# EAGLE design led3x3 (EAGLE 7.1.0)
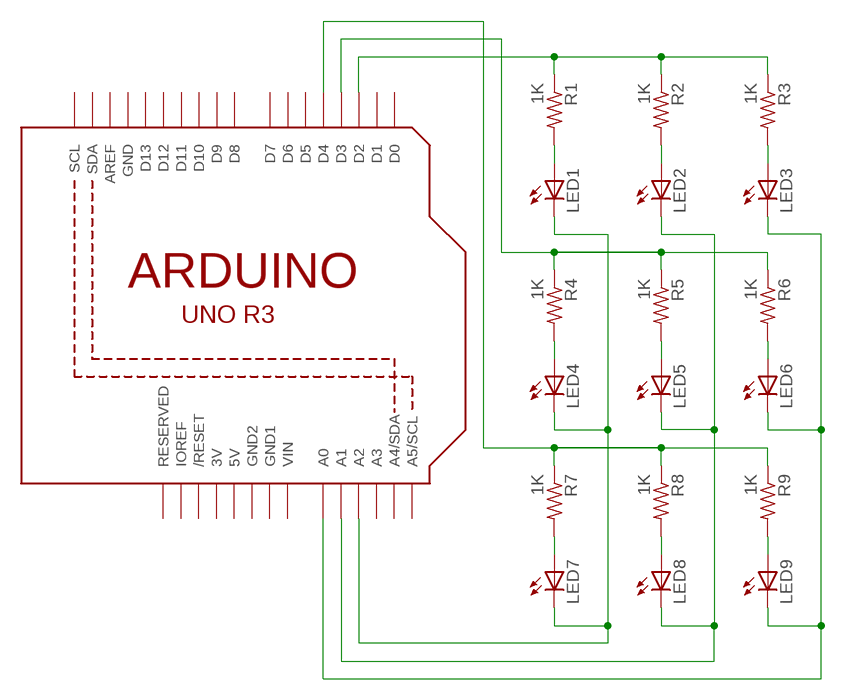
[diagram p0: schematic, sheet 1]

## Parts
LED1  LED5MM  [LED5MM]
LED2  LED5MM  [LED5MM]
LED3  LED5MM  [LED5MM]
LED4  LED5MM  [LED5MM]
LED5  LED5MM  [LED5MM]
LED6  LED5MM  [LED5MM]
LED7  LED5MM  [LED5MM]
LED8  LED5MM  [LED5MM]
LED9  LED5MM  [LED5MM]
R1  1K  R-US_0207/10  [0207/10]
R2  1K  R-US_0207/10  [0207/10]
R3  1K  R-US_0207/10  [0207/10]
R4  1K  R-US_0207/10  [0207/10]
R5  1K  R-US_0207/10  [0207/10]
R6  1K  R-US_0207/10  [0207/10]
R7  1K  R-US_0207/10  [0207/10]
R8  1K  R-US_0207/10  [0207/10]
R9  1K  R-US_0207/10  [0207/10]
U1  ARDUINOR3-BPLACE  [ARDUINOR3-BPLACE]

## Nets
D3: R4.1 R5.1 R6.1 U1.D3
N$1: LED3.K(C) LED6.K(C) LED9.K(C) U1.A0
N$2: LED1.A R1.2
N$3: LED2.K(C) LED5.K(C) LED8.K(C) U1.A1
N$4: R1.1 R2.1 R3.1 U1.D2
N$5: LED2.A R2.2
N$6: R7.1 R8.1 R9.1 U1.D4
N$7: LED1.K(C) LED4.K(C) LED7.K(C) U1.A2
N$8: LED3.A R3.2
N$11: LED4.A R4.2
N$14: LED5.A R5.2
N$17: LED6.A R6.2
N$20: LED7.A R7.2
N$23: LED8.A R8.2
N$26: LED9.A R9.2
Unconnected: U1.A3 U1.A4(A4/SDA) U1.A5(A5/SCL) U1.AREF U1.D0 U1.D1 U1.D5 U1.D6 U1.D7 U1.D8 U1.D9 U1.D10 U1.D11 U1.D12 U1.D13 U1.IOREF U1.RESERVED U1.RESET(/RESET) U1.SCL U1.SDA

## Power pins joined to a net without a drawn wire
3V: U1.3V
5V: U1.5V
GND: U1.GND
GND1: U1.GND1
GND2: U1.GND2
VIN: U1.VIN

## Library data of the parts
LED1-LED9 = led:LED: LED OSRAM: - CHIPLED LG R971, LG N971, LY N971, LG Q971, LY Q971, LO R971, LY R971 LH N974, LH R974 LS Q976, LO Q976, LY Q976 LO Q996 - Hyper CHIPLED LW Q18S LB Q993, LB Q99A, LB R99A - SideLED LS A670, LO A670, LY A670, LG A670, LP A670 LB A673, LV A673, LT A673, LW A673 LH A674 LY A675 LS A676, LA A676, LO A676, LY A676, LW A676 LS A679, LY A679, LG A679 - Hyper Micro SIDELED® LS Y876, LA Y876, LO Y876, LY Y876 LT Y87S - SmartLED LW L88C, LW L88S LB L89C, LB L89S, LG L890 LS L89K, LO L89K, LY L89K LS L896, LA L896, LO L896, LY L896 - TOPLED LS T670, LO T670, LY T670, LG T670, LP T670 LSG T670, LSP T670, LSY T670, LOP T670, LYG T670 LG T671, LOG T671, LSG T671 LB T673, LV T673, LT T673, LW T673 LH T674 LS T676, LA T676, LO T676, LY T676, LB T676, LH T676, LSB T676, LW T676 LB T67C, LV T67C, LT T67C, LS T67K, LO T67K, LY T67K, LW E67C LS E67B, LA E67B, LO E67B, LY E67B, LB E67C, LV E67C, LT E67C LW T67C LS T679, LY T679, LG T679 LS T770, LO T770, LY T770, LG T770, LP T770 LB T773, LV T773, LT T773, LW T773 LH T774 LS E675, LA E675, LY E675, LS T675 LS T776, LA T776, LO T776, LY T776, LB T776 LHGB T686 LT T68C, LB T68C - Hyper Mini TOPLED® LB M676 - Mini TOPLED Santana® LG M470 LS M47K, LO M47K, LY M47K Source: http://www.osram.convergy.de LUXEON: - LUMILED® LXK2-PW12-R00, LXK2-PW12-S00, LXK2-PW14-U00, LXK2-PW14-V00 LXK2-PM12-R00, LXK2-PM12-S00, LXK2-PM14-U00 LXK2-PE12-Q00, LXK2-PE12-R00, LXK2-PE12-S00, LXK2-PE14-T00, LXK2-PE14-U00 LXK2-PB12-K00, LXK2-PB12-L00, LXK2-PB12-M00, LXK2-PB14-N00, LXK2-PB14-P00, LXK2-PB14-Q00 LXK2-PR12-L00, LXK2-PR12-M00, LXK2-PR14-Q00, LXK2-PR14-R00 LXK2-PD12-Q00, LXK2-PD12-R00, LXK2-PD12-S00 LXK2-PH12-R00, LXK2-PH12-S00 LXK2-PL12-P00, LXK2-PL12-Q00, LXK2-PL12-R00 Source: www.luxeon.com KINGBRIGHT: KA-3528ASYC Source: www.kingbright.com
R1-R9 = resistor:R-US_: RESISTOR, American symbol
U1 = adafruit:ARDUINOR3: This is a new object for the new Arduino R3 - with extra pins that you may want to use (such as IOref, and duplicated A4/A5

## Board
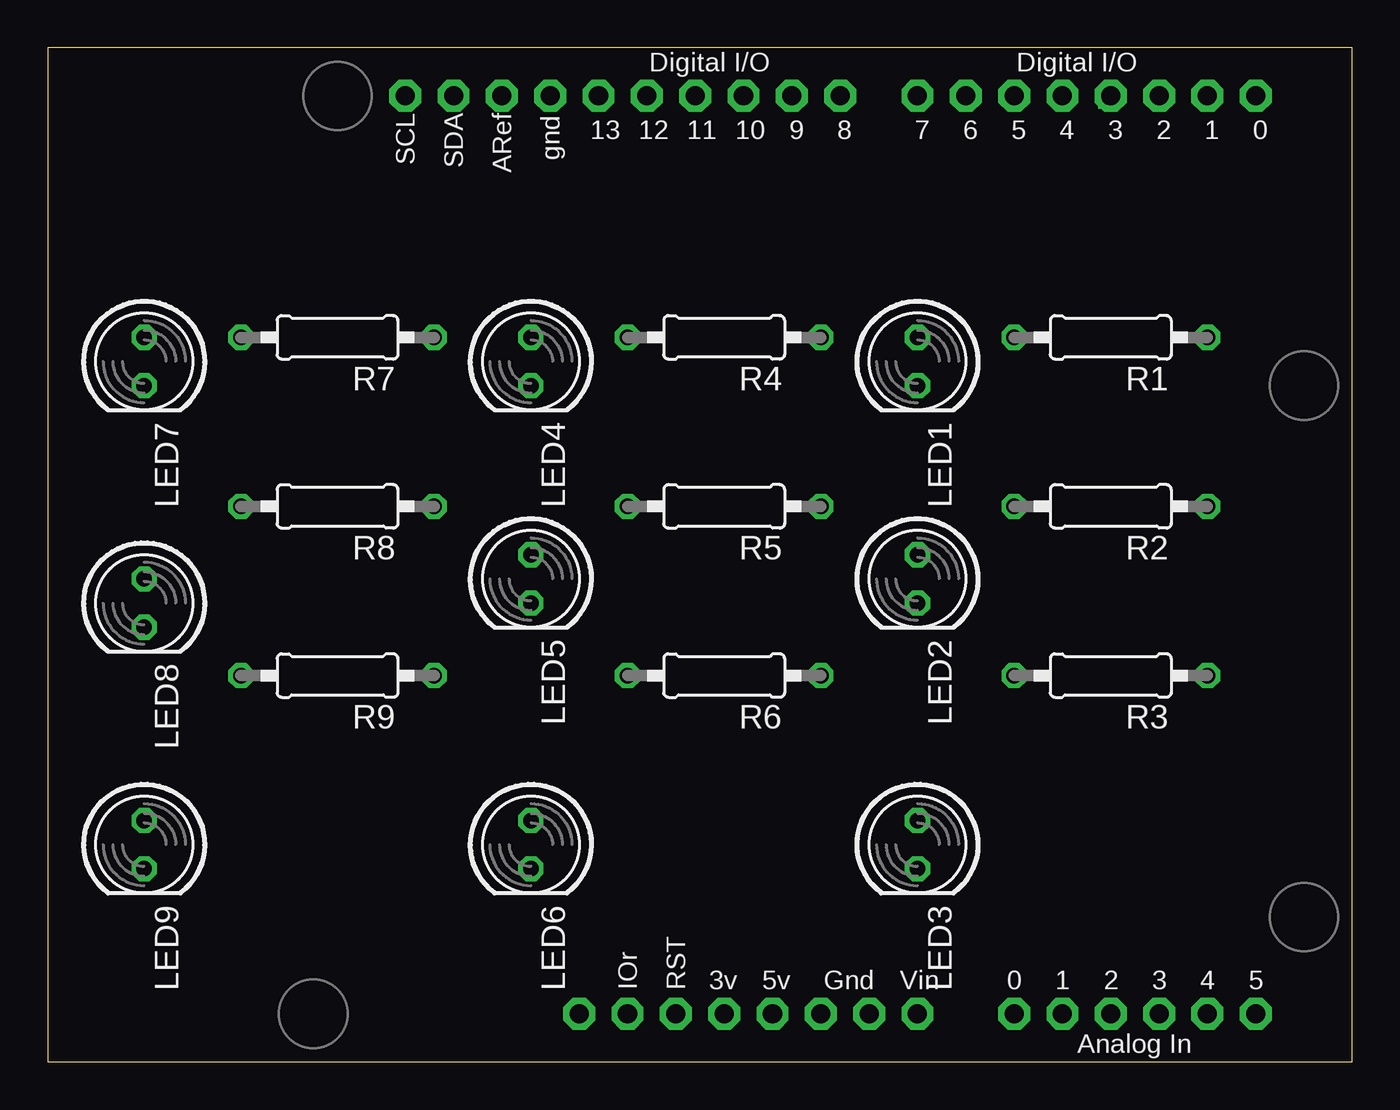
[diagram p1: board, top side]
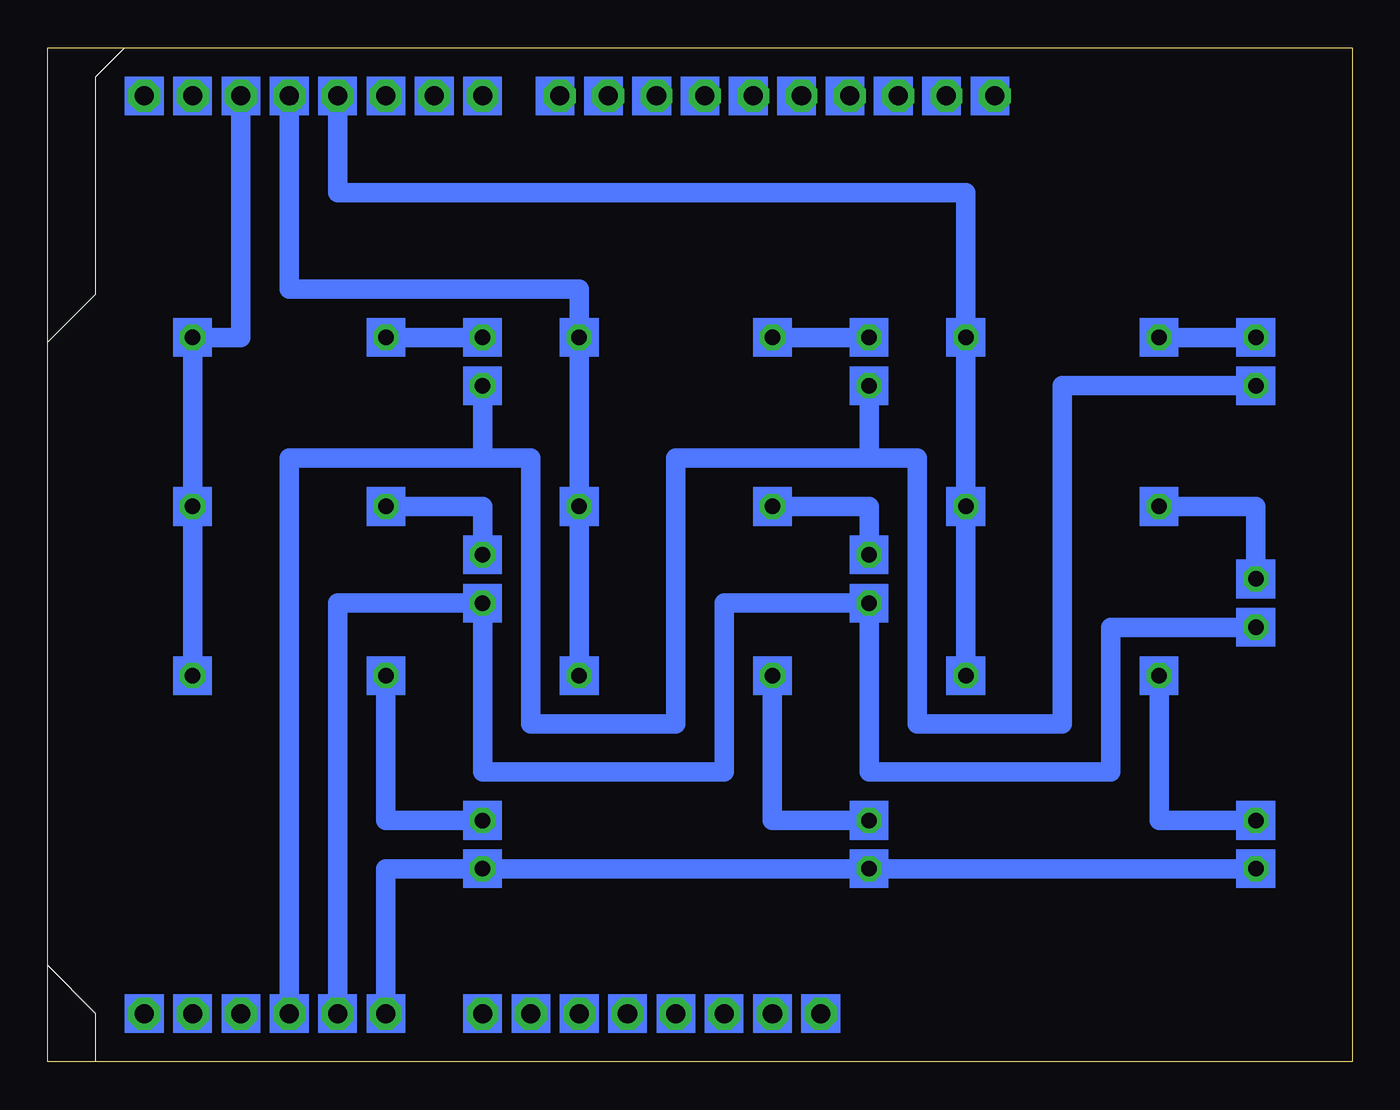
[diagram p2: board, bottom side, seen from below]

Size 68.58 x 53.34 mm. Coordinates in mm from the lower left corner, seen from the top.
Outline: 0,0 68.58,0 68.58,53.34 0,53.34 0,0
Copper layers (1*16): Top 0.035mm / dielectric 1.5mm / Bottom 0.035mm
Design rules "default": minimum track width 10mil, minimum drill 24mil, track to track 8mil, track to pad 8mil, pad to pad 8mil, via to via 8mil, smd to smd 8mil, copper to edge 40mil, drill to drill 8mil, minimum pad ring 10mil, minimum via ring 8mil, stop-mask expansion 4mil, vias tented up to drill 0mil, thermal gap 10mil

### Footprints (pad centres in the part's own frame; a part is rotated, then mirrored left to right if it is on the bottom)
LED5MM = drill 0.813 octagon: A -1.27,0; K 1.27,0
0207/10 = drill 0.813 octagon: 1 -5.08,0; 2 5.08,0
ARDUINOR3-BPLACE = drill 1 pad 1.676 octagon: 3V 35.56,2.54; 5V 38.1,2.54; A0 50.8,2.54; A1 53.34,2.54; A2 55.88,2.54; A3 58.42,2.54; A4 60.96,2.54; A5 63.5,2.54; AREF 23.876,50.8; D0 63.5,50.8; D1 60.96,50.8; D2 58.42,50.8; D3 55.88,50.8; D4 53.34,50.8; D5 50.8,50.8; D6 48.26,50.8; D7 45.72,50.8; D8 41.656,50.8; D9 39.116,50.8; D10 36.576,50.8; D11 34.036,50.8; D12 31.496,50.8; D13 28.956,50.8; GND 26.416,50.8; GND1 43.18,2.54; GND2 40.64,2.54; IOREF 30.48,2.54; RESERVED 27.94,2.54; RESET 33.02,2.54; SCL 18.796,50.8; SDA 21.336,50.8; VIN 45.72,2.54

### Placement (x,y rotation side)
LED1  45.72,36.83 270 top
LED2  45.72,25.4 270 top
LED3  45.72,11.43 270 top
LED4  25.4,36.83 270 top
LED5  25.4,25.4 270 top
LED6  25.4,11.43 270 top
LED7  5.08,36.83 270 top
LED8  5.08,24.13 270 top
LED9  5.08,11.43 270 top
R1  55.88,38.1 180 top
R2  55.88,29.21 180 top
R3  55.88,20.32 180 top
R4  35.56,38.1 180 top
R5  35.56,29.21 180 top
R6  35.56,20.32 180 top
R7  15.24,38.1 180 top
R8  15.24,29.21 180 top
R9  15.24,20.32 180 top
U1  0,0 0 top

### Tracks (layer width: path | path; a pad name or v marks a point on that pad's centre or on a via)
D3  (via drill 0.6)
  Top 0.254: v55.73,50.62 U1.D3
  Bottom 1.016: R6.1 R5.1 R4.1 40.64,40.64 55.88,40.64 U1.D3
N$1
  Bottom 1.016: LED9.K LED6.K LED3.K 50.8,10.16 U1.A0
N$2
  Bottom 1.016: R1.2 LED1.A
N$3
  Bottom 1.016: LED8.K 12.7,22.86 12.7,15.24 25.4,15.24 LED5.K 33.02,24.13 33.02,15.24 45.72,15.24 LED2.K 53.34,24.13 U1.A1
N$4
  Bottom 1.016: U1.D2 58.42,38.1 R1.1 R2.1 R3.1
N$5
  Bottom 1.016: R2.2 45.72,29.21 LED2.A
N$6
  Bottom 1.016: U1.D4 53.34,45.72 20.32,45.72 R7.1 R8.1 R9.1
N$7
  Bottom 1.016: LED7.K 15.24,35.56 15.24,17.78 22.86,17.78 22.86,31.75 25.4,31.75 | 45.72,31.75 55.88,31.75 U1.A2 | LED4.K 25.4,31.75 | 25.4,31.75 35.56,31.75 35.56,17.78 43.18,17.78 43.18,31.75 45.72,31.75 | 45.72,31.75 LED1.K
N$8
  Bottom 1.016: R3.2 50.8,12.7 LED3.A
N$11
  Bottom 1.016: R4.2 LED4.A
N$14
  Bottom 1.016: R5.2 25.4,29.21 LED5.A
N$17
  Bottom 1.016: R6.2 30.48,12.7 LED6.A
N$20
  Bottom 1.016: R7.2 LED7.A
N$23
  Bottom 1.016: R8.2 5.08,29.21 LED8.A
N$26
  Bottom 1.016: R9.2 10.16,12.7 LED9.A
(copper drawn outside any net)
  shapes: Bottom area x68